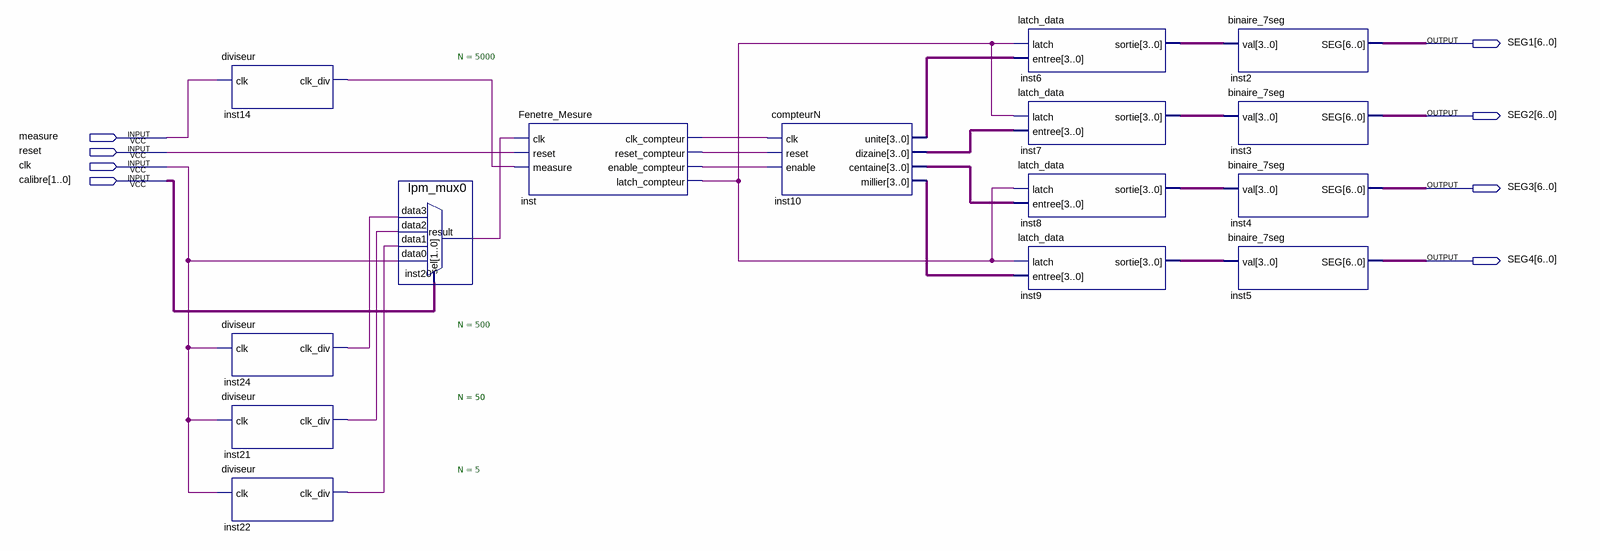
[diagram p0: schematic sheet]
// Quartus schematic TP23.bdf as structural Verilog: 15 symbols, 8 pins
module TP23 (
  input  measure,
  input  reset,
  input  clk,
  input  [1:0] calibre,
  output [6:0] SEG1,
  output [6:0] SEG2,
  output [6:0] SEG3,
  output [6:0] SEG4
);

  wire inst14_clk_div, inst20_result, inst21_clk_div, inst22_clk_div, inst24_clk_div, inst_clk_compteur,
       inst_enable_compteur, inst_latch_compteur, inst_reset_compteur;
  wire [3:0] inst6_sortie, inst7_sortie, inst8_sortie, inst9_sortie, inst10_centaine, inst10_dizaine,
       inst10_millier, inst10_unite;

  diviseur #(.N(5000)) inst14 (.clk(measure), .clk_div(inst14_clk_div));
  diviseur #(.N(500)) inst24 (.clk(clk), .clk_div(inst24_clk_div));
  diviseur #(.N(50)) inst21 (.clk(clk), .clk_div(inst21_clk_div));
  diviseur #(.N(5)) inst22 (.clk(clk), .clk_div(inst22_clk_div));
  lpm_mux0 inst20 (
    .data3(inst24_clk_div), .data2(inst21_clk_div), .data1(inst22_clk_div), .data0(clk), .sel(calibre),
    .result(inst20_result));
  Fenetre_Mesure inst (
    .clk(inst20_result), .reset(reset), .measure(inst14_clk_div), .clk_compteur(inst_clk_compteur),
    .reset_compteur(inst_reset_compteur), .enable_compteur(inst_enable_compteur),
    .latch_compteur(inst_latch_compteur));
  compteurN inst10 (
    .clk(inst_clk_compteur), .reset(inst_reset_compteur), .enable(inst_enable_compteur),
    .unite(inst10_unite), .dizaine(inst10_dizaine), .centaine(inst10_centaine), .millier(inst10_millier));
  latch_data inst6 (.latch(inst_latch_compteur), .entree(inst10_unite), .sortie(inst6_sortie));
  latch_data inst7 (.latch(inst_latch_compteur), .entree(inst10_dizaine), .sortie(inst7_sortie));
  latch_data inst8 (.latch(inst_latch_compteur), .entree(inst10_centaine), .sortie(inst8_sortie));
  latch_data inst9 (.latch(inst_latch_compteur), .entree(inst10_millier), .sortie(inst9_sortie));
  binaire_7seg inst2 (.val(inst6_sortie), .SEG(SEG1));
  binaire_7seg inst3 (.val(inst7_sortie), .SEG(SEG2));
  binaire_7seg inst4 (.val(inst8_sortie), .SEG(SEG3));
  binaire_7seg inst5 (.val(inst9_sortie), .SEG(SEG4));
endmodule
